# Altium schematic sheet Capx3_small_bypass.SchDoc
size A
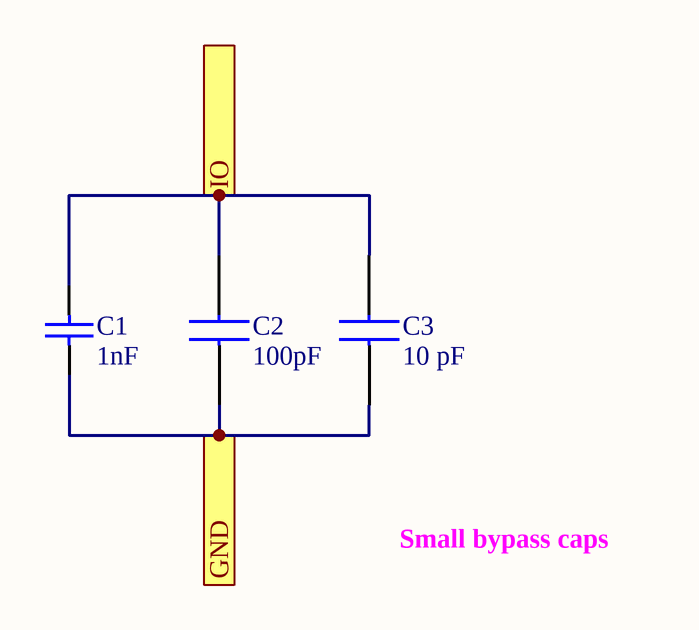
[diagram p0: Capx3_small_bypass.SchDoc]

## Parts
C1  value 1nF  [Samsung CL21B Series]  (hidden comment: Cap 1nF 0805)
C2  100pF  [CAPC1608X90N]
C3  10 pF  [CAPC2012X88N]

## Ports
GND, IO

## Nets
GND: C1.2 C2.1 C3.1 ; port GND
IO: C1.1 C2.2 C3.2 ; port IO

## Notes on the sheet
- Small bypass caps

## Library data of the parts
C1 = Cap 1nF 0805: Ceramic Capacitor, Multilayer, Ceramic, 50V, 10% +Tol, 10% -Tol, X7R, 15% TC, 0.001uF, Surface Mount, 0805; Supplier 1: Digi-Key; Supplier Part Number 1: 1276-2424-1-ND
C2 = Cap 100pF 0603: Capacitor; Manufacturer_Name: AVX; Manufacturer_Part_Number: 06035A101FAT2A; Datasheet Link: https://componentsearchengine.com/Datasheets/1/06031A100FAT2A.pdf; Height: 0.9mm; Mouser Part Number: 581-06035A101F; Mouser Price/Stock: https://www.mouser.co.uk/ProductDetail/AVX/06035A101FAT2A?qs=AGOxcRBkg6ajfVvm2Jvp8A%3D%3D; Arrow Part Number: 06035A101FAT2A; Arrow Price/Stock: https://www.arrow.com/en/products/06035a101fat2a/avx?region=nac; Supplier 1: Digi-Key; Supplier Part Number 1: 478-6202-1-ND
C3 = Cap 10pF 0805: Capacitor; Manufacturer_Name: Kemet; Manufacturer_Part_Number: C0805C100J5GACTU; Datasheet Link: http://www.mouser.com/ds/2/212/KEM_C1003_C0G_SMD-356956.pdf; Height: 0.88mm; Mouser Part Number: 80-C0805C100J5G; Mouser Price/Stock: https://www.mouser.co.uk/ProductDetail/KEMET/C0805C100J5GACTU?qs=nxj9Bpd7lumc4YIny1qjLA%3D%3D; Arrow Part Number: C0805C100J5GACTU; Arrow Price/Stock: https://www.arrow.com/en/products/c0805c100j5gactu/kemet-corporation?region=nac; Supplier 1: Digi-Key; Supplier Part Number 1: 399-C0805C100J5GAC7800CT-ND